# Altium schematic sheet DSP_min_system.SchDoc
size A2
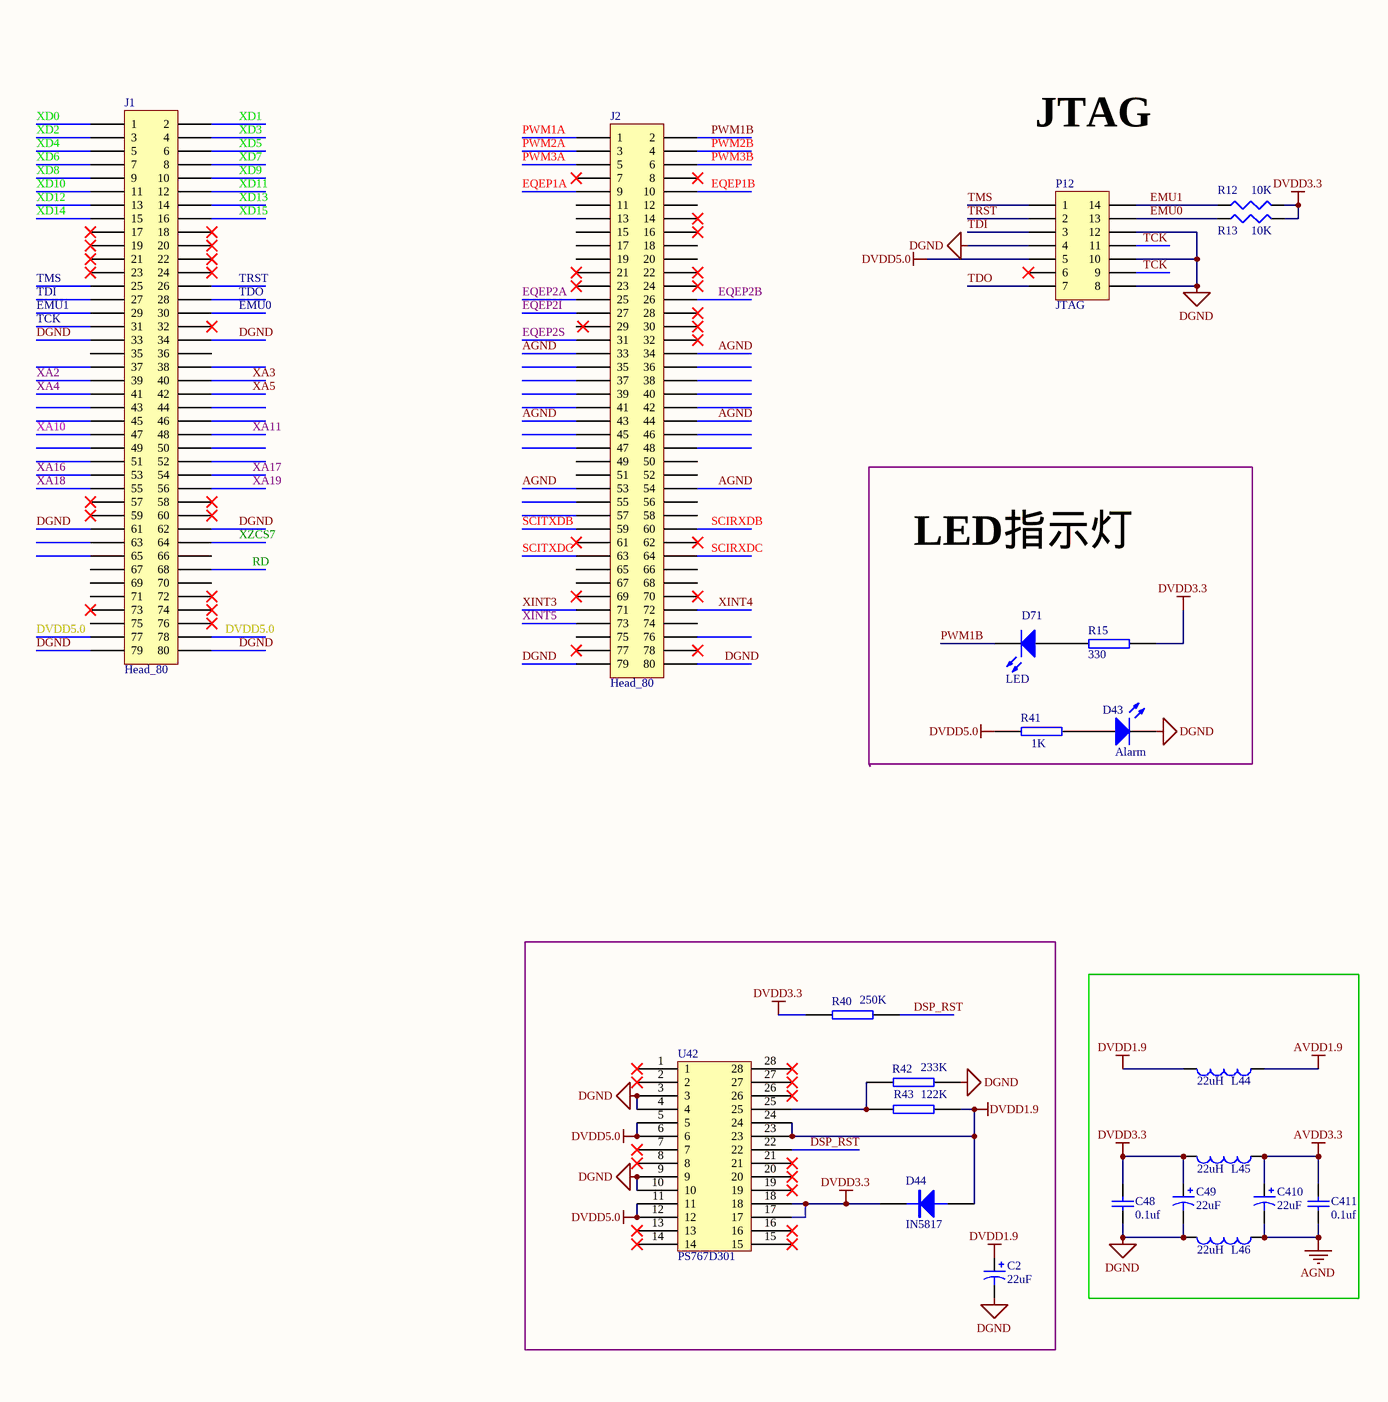
[diagram p0: DSP_min_system.SchDoc, left]
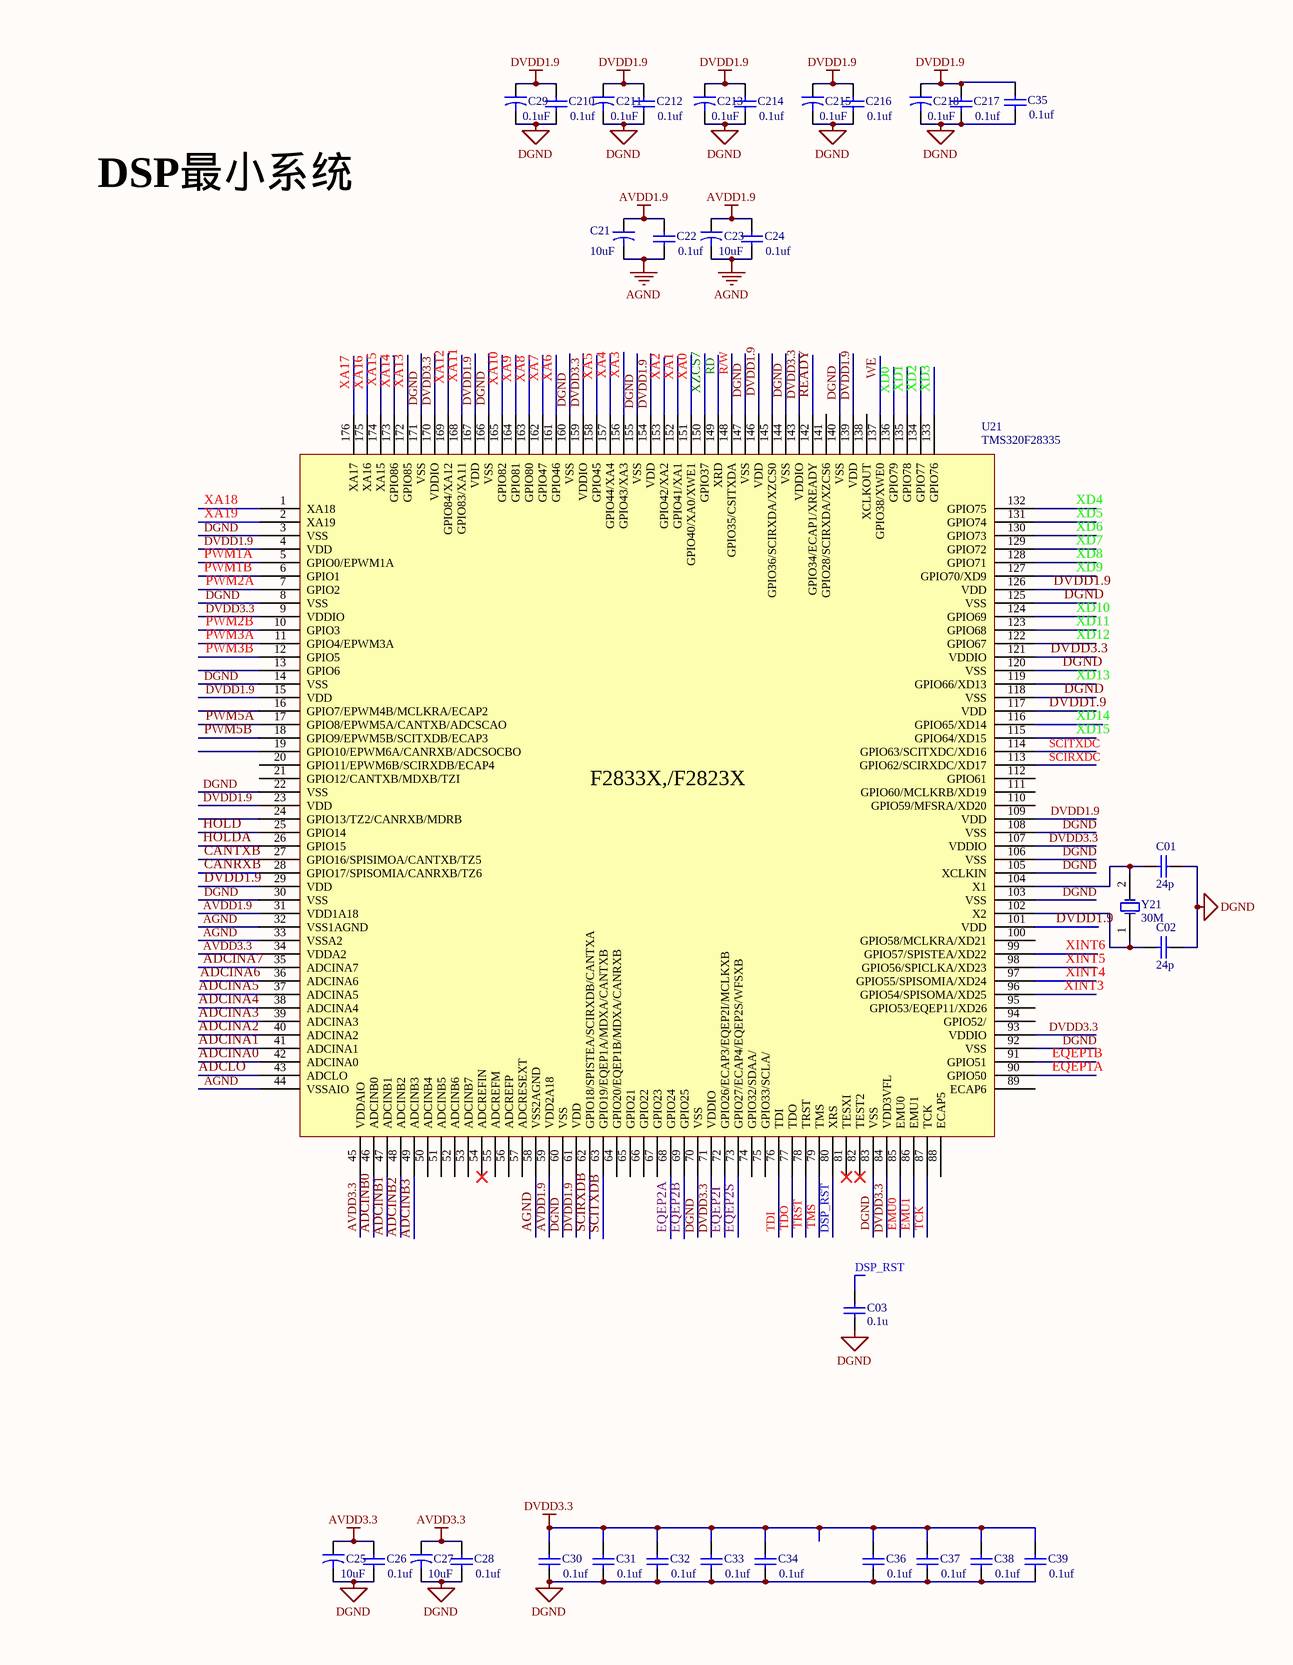
[diagram p1: DSP_min_system.SchDoc, right]

## Parts
C01  value 24p  [CC0805]  (hidden comment: Cap)
C02  value 24p  [CC0805]  (hidden comment: Cap)
C2  value 22uF  [1206]  (hidden comment: Cap Pol1)
C03  value 0.1u  [0603-1]  (hidden comment: Cap)
C21  value 10uF  [CC0805]  (hidden comment: Cap2)
C22  value 0.1uf  [0603-1]  (hidden comment: Cap)
C23  value 10uF  [CC0805]  (hidden comment: Cap2)
C24  value 0.1uf  [0603-1]  (hidden comment: Cap)
C25  value 10uF  [CC0805]  (hidden comment: Cap2)
C26  value 0.1uf  [0603-1]  (hidden comment: Cap)
C27  value 10uF  [CC0805]  (hidden comment: Cap2)
C28  value 0.1uf  [0603-1]  (hidden comment: Cap)
C29  value 0.1uF  [0603-1]  (hidden comment: Cap2)
C30  value 0.1uf  [0603-1]  (hidden comment: Cap)
C31  value 0.1uf  [0603-1]  (hidden comment: Cap)
C32  value 0.1uf  [0603-1]  (hidden comment: Cap)
C33  value 0.1uf  [0603-1]  (hidden comment: Cap)
C34  value 0.1uf  [0603-1]  (hidden comment: Cap)
C35  value 0.1uf  [0603-1]  (hidden comment: Cap)
C36  value 0.1uf  [0603-1]  (hidden comment: Cap)
C37  value 0.1uf  [0603-1]  (hidden comment: Cap)
C38  value 0.1uf  [0603-1]  (hidden comment: Cap)
C39  value 0.1uf  [0603-1]  (hidden comment: Cap)
C48  value 0.1uf  [0603-1]  (hidden comment: Cap)
C49  value 22uF  [1206]  (hidden comment: Cap Pol1)
C210  value 0.1uf  [0603-1]  (hidden comment: Cap)
C211  value 0.1uF  [0603-1]  (hidden comment: Cap2)
C212  value 0.1uf  [0603-1]  (hidden comment: Cap)
C213  value 0.1uF  [0603-1]  (hidden comment: Cap2)
C214  value 0.1uf  [0603-1]  (hidden comment: Cap)
C215  value 0.1uF  [0603-1]  (hidden comment: Cap2)
C216  value 0.1uf  [0603-1]  (hidden comment: Cap)
C217  value 0.1uf  [0603-1]  (hidden comment: Cap)
C218  value 0.1uF  [0603-1]  (hidden comment: Cap2)
C410  value 22uF  [1206]  (hidden comment: Cap Pol1)
C411  value 0.1uf  [0603-1]  (hidden comment: Cap)
D43  Alarm  [LED_0805]
D44  IN5817  [1206]
D71  LED  [LED_0805]
J1  Head_80  [P80-2.0mm]
J2  Head_80  [P80-2.0mm]
L44  value 22uH  [CC0805]  (hidden comment: Inductor)
L45  value 22uH  [CC0805]  (hidden comment: Inductor)
L46  value 22uH  [CC0805]  (hidden comment: Inductor)
P12  JTAG  [HDR7X2_A1]
R12  value 10K  [0805-2]  (hidden comment: Res3)
R13  value 10K  [0805-2]  (hidden comment: Res3)
R15  330  [0805-2]
R40  250K  [0805-2]
R41  1K  [0805-2]
R42  233K  [0805-2]
R43  122K  [0805-2]
U21  TMS320F28335  [tms320F28335]
U42  PS767D301  [TSOP28]
Y21  30M  [晶振]

## Nets
AGND: C21.2 C22.1 C23.2 C24.1 C410.2 C411.2 J2.33 J2.34 J2.43 J2.44 J2.53 J2.54 L46.1 U21.32(VSS1AGND) U21.33(VSSA2) U21.44(VSSAIO) U21.58(VSS2AGND)
AVDD1.9: C21.1 C22.2 C23.1 C24.2 L44.1 U21.31(VDD1A18) U21.59(VDD2A18)
AVDD3.3: C25.1 C26.2 C27.1 C28.2 C410.1 C411.1 L45.1 U21.34(VDDA2) U21.45(VDDAIO)
DGND: C01.1 C02.1 C2.2 C03.2 C25.2 C26.1 C27.2 C28.1 C29.2 C30.1 C31.1 C32.1 C33.1 C34.1 C35.1 C36.1 C37.1 C38.1 C39.1 C48.2 C49.2 C210.1 C211.2 C212.1 C213.2 C214.1 C215.2 C216.1 C217.1 C218.2 D43.2(K) J1.33 J1.34 J1.61 J1.62 J1.79 J1.80 J2.79 J2.80 L46.2 P12.4 P12.8 P12.10 P12.12 R42.1 U21.3(VSS) U21.8(VSS) U21.14(VSS) U21.22(VSS) U21.30(VSS) U21.60(VSS) U21.70(VSS) U21.83(VSS) U21.92(VSS) U21.103(VSS) U21.105(XCLKIN) U21.106(VSS) U21.108(VSS) U21.118(VSS) U21.120(VSS) U21.125(VSS) U21.140(VSS) U21.144(VSS) U21.147(VSS) U21.155(VSS) U21.160(VSS) U21.166(VSS) U21.171(VSS) U42.3 U42.4 U42.9 U42.10
DVDD1.9: C2.1 C29.1 C35.2 C210.2 C211.1 C212.2 C213.1 C214.2 C215.1 C216.2 C217.2 C218.1 D44.1(A) L44.2 R43.1 U21.4(VDD) U21.15(VDD) U21.23(VDD) U21.29(VDD) U21.61(VDD) U21.101(VDD) U21.109(VDD) U21.117(VDD) U21.126(VDD) U21.139(VDD) U21.146(VDD) U21.154(VDD) U21.167(VDD) U42.23 U42.24
DVDD3.3: C30.2 C31.2 C32.2 C33.2 C34.2 C36.2 C37.2 C38.2 C39.2 C48.1 C49.1 D44.2(K) L45.2 R12.2 R13.2 R15.2 R40.2 U21.9(VDDIO) U21.71(VDDIO) U21.84(VDD3VFL) U21.93(VDDIO) U21.107(VDDIO) U21.121(VDDIO) U21.143(VDDIO) U21.159(VDDIO) U21.170(VDDIO) U42.17 U42.18
DVDD5.0: J1.77 J1.78 P12.5 R41.2 U42.5 U42.6 U42.11 U42.12
ADCINA0: U21.42(ADCINA0)
ADCINA1: U21.41(ADCINA1)
ADCINA2: U21.40(ADCINA2)
ADCINA3: U21.39(ADCINA3)
ADCINA4: U21.38(ADCINA4)
ADCINA5: U21.37(ADCINA5)
ADCINA6: U21.36(ADCINA6)
ADCINA7: U21.35(ADCINA7)
ADCINB0: U21.46(ADCINB0)
ADCINB1: U21.47(ADCINB1)
ADCINB2: U21.48(ADCINB2)
ADCINB3: U21.49(ADCINB3)
ADCLO: U21.43(ADCLO)
CANRXB: U21.28(GPIO17/SPISOMIA/CANRXB/TZ6)
CANTXB: U21.27(GPIO16/SPISIMOA/CANTXB/TZ5)
DSP_RST: C03.1 R40.1 U21.80(XRS) U42.22
EMU0: J1.30 P12.13 R13.1 U21.85(EMU0)
EMU1: J1.29 P12.14 R12.1 U21.86(EMU1)
EQEP1A: J2.9 U21.90(GPIO50)
EQEP1B: J2.10 U21.91(GPIO51)
EQEP2A: J2.25 U21.68(GPIO24)
EQEP2B: J2.26 U21.69(GPIO25)
EQEP2I: J2.27 U21.72(GPIO26/ECAP3/EQEP2I/MCLKXB)
EQEP2S: J2.31 U21.73(GPIO27/ECAP4/EQEP2S/WFSXB)
HOLD: U21.25(GPIO14)
HOLDA: U21.26(GPIO15)
PWM1A: J2.1 U21.5(GPIO0/EPWM1A)
PWM1B: D71.2(K) J2.2 U21.6(GPIO1)
PWM2A: J2.3 U21.7(GPIO2)
PWM2B: J2.4 U21.10(GPIO3)
PWM3A: J2.5 U21.11(GPIO4/EPWM3A)
PWM3B: J2.6 U21.12(GPIO5)
PWM5A: U21.17(GPIO8/EPWM5A/CANTXB/ADCSCAO)
PWM5B: U21.18(GPIO9/EPWM5B/SCITXDB/ECAP3)
R/W: U21.148(GPIO35/CSITXDA)
RD: J1.68 U21.149(XRD)
READY: U21.142(GPIO34/ECAP1/XREADY)
SCIRXDB: J2.60 U21.62(GPIO18/SPISTEA/SCIRXDB/CANTXA)
SCIRXDC: J2.64 U21.113(GPIO62/SCIRXDC/XD17)
SCITXDB: J2.59 U21.63(GPIO19/EQEP1A/MDXA/CANTXB)
SCITXDC: J2.63 U21.114(GPIO63/SCITXDC/XD16)
TCK: J1.31 P12.9 P12.11 U21.87(TCK)
TDI: J1.27 P12.3 U21.76(TDI)
TDO: J1.28 P12.7 U21.77(TDO)
TMS: J1.25 P12.1 U21.79(TMS)
TRST: J1.26 P12.2 U21.78(TRST)
WE: U21.137(GPIO38/XWE0)
XA0: U21.151(GPIO40/XA0/XWE1)
XA1: U21.152(GPIO41/XA1)
XA2: J1.39 U21.153(GPIO42/XA2)
XA3: J1.40 U21.156(GPIO43/XA3)
XA4: J1.41 U21.157(GPIO44/XA4)
XA5: J1.42 U21.158(GPIO45)
XA6: U21.161(GPIO46)
XA7: U21.162(GPIO47)
XA8: U21.163(GPIO80)
XA9: U21.164(GPIO81)
XA10: J1.47 U21.165(GPIO82)
XA11: J1.48 U21.168(GPIO83/XA11)
XA12: U21.169(GPIO84/XA12)
XA13: U21.172(GPIO85)
XA14: U21.173(GPIO86)
XA15: U21.174(XA15)
XA16: J1.53 U21.175(XA16)
XA17: J1.54 U21.176(XA17)
XA18: J1.55 U21.1(XA18)
XA19: J1.56 U21.2(XA19)
XD0: J1.1 U21.136(GPIO79)
XD1: J1.2 U21.135(GPIO78)
XD2: J1.3 U21.134(GPIO77)
XD3: J1.4 U21.133(GPIO76)
XD4: J1.5 U21.132(GPIO75)
XD5: J1.6 U21.131(GPIO74)
XD6: J1.7 U21.130(GPIO73)
XD7: J1.8 U21.129(GPIO72)
XD8: J1.9 U21.128(GPIO71)
XD9: J1.10 U21.127(GPIO70/XD9)
XD10: J1.11 U21.124(GPIO69)
XD11: J1.12 U21.123(GPIO68)
XD12: J1.13 U21.122(GPIO67)
XD13: J1.14 U21.119(GPIO66/XD13)
XD14: J1.15 U21.116(GPIO65/XD14)
XD15: J1.16 U21.115(GPIO64/XD15)
XINT3: J2.71 U21.96(GPIO54/SPISOMA/XD25)
XINT4: J2.72 U21.97(GPIO55/SPISOMIA/XD24)
XINT5: J2.73 U21.98(GPIO56/SPICLKA/XD23)
XINT6: U21.99(GPIO57/SPISTEA/XD22)
XZCS7: J1.64 U21.150(GPIO37)
NetC01_2: C01.2 U21.104(X1) Y21.2(OSC2)
NetC02_2: C02.2 U21.102(X2) Y21.1(OSC1)
NetD43_1: D43.1(A) R41.1
NetD71_1: D71.1(A) R15.1
NetR42_2: R42.2 R43.2 U42.25

Not connected (* = marked no-connect by the designer): J1 17* 18* 19* 20* 21* 22* 23* 24* 32* 35 36 37 38 43 44 45 46 49 50 51 52 57* 58* 59* 60* 63 65 66 67 69 70 71 72* 73* 74* 75 76*; J2 7* 8* 11 12 13 14* 15 16* 17 18 19 20 21* 22* 23* 24* 28* 29 30* 32* 35 36 37 38 39 40 41 42 45 46 47 48 49 50 51 52 55 56 57 58 61* 62* 65 66 67 68 69* 70* 74 75 76 77* 78*; P12 6*; U21 13(GPIO6) 16(GPIO7/EPWM4B/MCLKRA/ECAP2) 19(GPIO10/EPWM6A/CANRXB/ADCSOCBO) 20(GPIO11/EPWM6B/SCIRXDB/ECAP4) 21(GPIO12/CANTXB/MDXB/TZI) 24(GPIO13/TZ2/CANRXB/MDRB) 50(ADCINB4) 51(ADCINB5) 52(ADCINB6) 53(ADCINB7) 54(ADCREFIN)* 55(ADCREFM) 56(ADCREFP) 57(ADCRESEXT) 64(GPIO20/EQEP1B/MDXA/CANRXB) 65(GPIO21) 66(GPIO22) 67(GPIO23) 74(GPIO32/SDAA/) 75(GPIO33/SCLA/) 81(TESXI)* 82(TEST2)* 88(ECAP5) 89(ECAP6) 94(GPIO52/) 95(GPIO53/EQEP11/XD26) 100(GPIO58/MCLKRA/XD21) 110(GPIO59/MFSRA/XD20) 111(GPIO60/MCLKRB/XD19) 112(GPIO61) 138(XCLKOUT) 141(GPIO28/SCIRXDA/XZCS6) 145(GPIO36/SCIRXDA/XZCS0); U42 1* 2* 7* 8* 13* 14* 15* 16* 19* 20* 21* 26* 27* 28*

## Notes on the sheet
- DSP最小系统
- JTAG
- LED指示灯
- (in symbol Component_1) F2833X,/F2823X

## Library data of the parts
C01 C02 C03 C22 C24 C26 C28 C30-C39 C48 C210 C212 C214 C216 C217 C411 = Cap: Capacitor; Published: 8-Jun-2000; LatestRevisionDate: 17-Jul-2002; LatestRevisionNote: Re-released for DXP Platform.; PackageReference: RAD-0.3; Publisher: Altium Limited
C2 C49 C410 = Cap Pol1: Polarized Capacitor (Radial); Published: 8-Jun-2000; LatestRevisionDate: 17-Jul-2002; LatestRevisionNote: Re-released for DXP Platform.; PackageReference: RB7.6-15; Publisher: Altium Limited
C21 C23 C25 C27 C29 C211 C213 C215 C218 = Cap2: Capacitor; Published: 23-Sep-2002; PackageReference: CAPR5-4X5; Publisher: Altium Limited
D43 D71 = LED0: Typical INFRARED GaAs LED; Published: 8-Jun-2000; LatestRevisionDate: 08-Jul-2005; LatestRevisionNote: Mech Layer 1 removed.; PackageReference: LED-0; Publisher: Altium Limited
D44 = DIODE
L44-L46 = Inductor: Code_IEC: 1005; Published: 8-Jun-2000; LatestRevisionDate: 29-May-2009; LatestRevisionNote: IPC-7351 Footprint Added.; PackageReference: 0402-A; Publisher: Altium Limited; PackageDescription: Chip Inductor; Code_JEITA: 0402
P12 = head7*2
R12 R13 = Res3: Resistor; Published: 8-Jun-2000; LatestRevisionDate: 04-Mar-2005; LatestRevisionNote: PCB Footprint replaced.; PackageReference: J1-0603; Publisher: Altium Limited
R15 R40-R43 = RES2
U21 = Component_1
Y21 = XTAL: Crystal Oscillator; Published: 8-Jun-2000; LatestRevisionDate: 17-Jul-2002; LatestRevisionNote: Re-released for DXP Platform.; PackageReference: R38; Publisher: Altium Limited